# EAGLE schematic LCmeter0-LCD3310-8pinlcd-PIC-COMP (EAGLE 7.6.0)
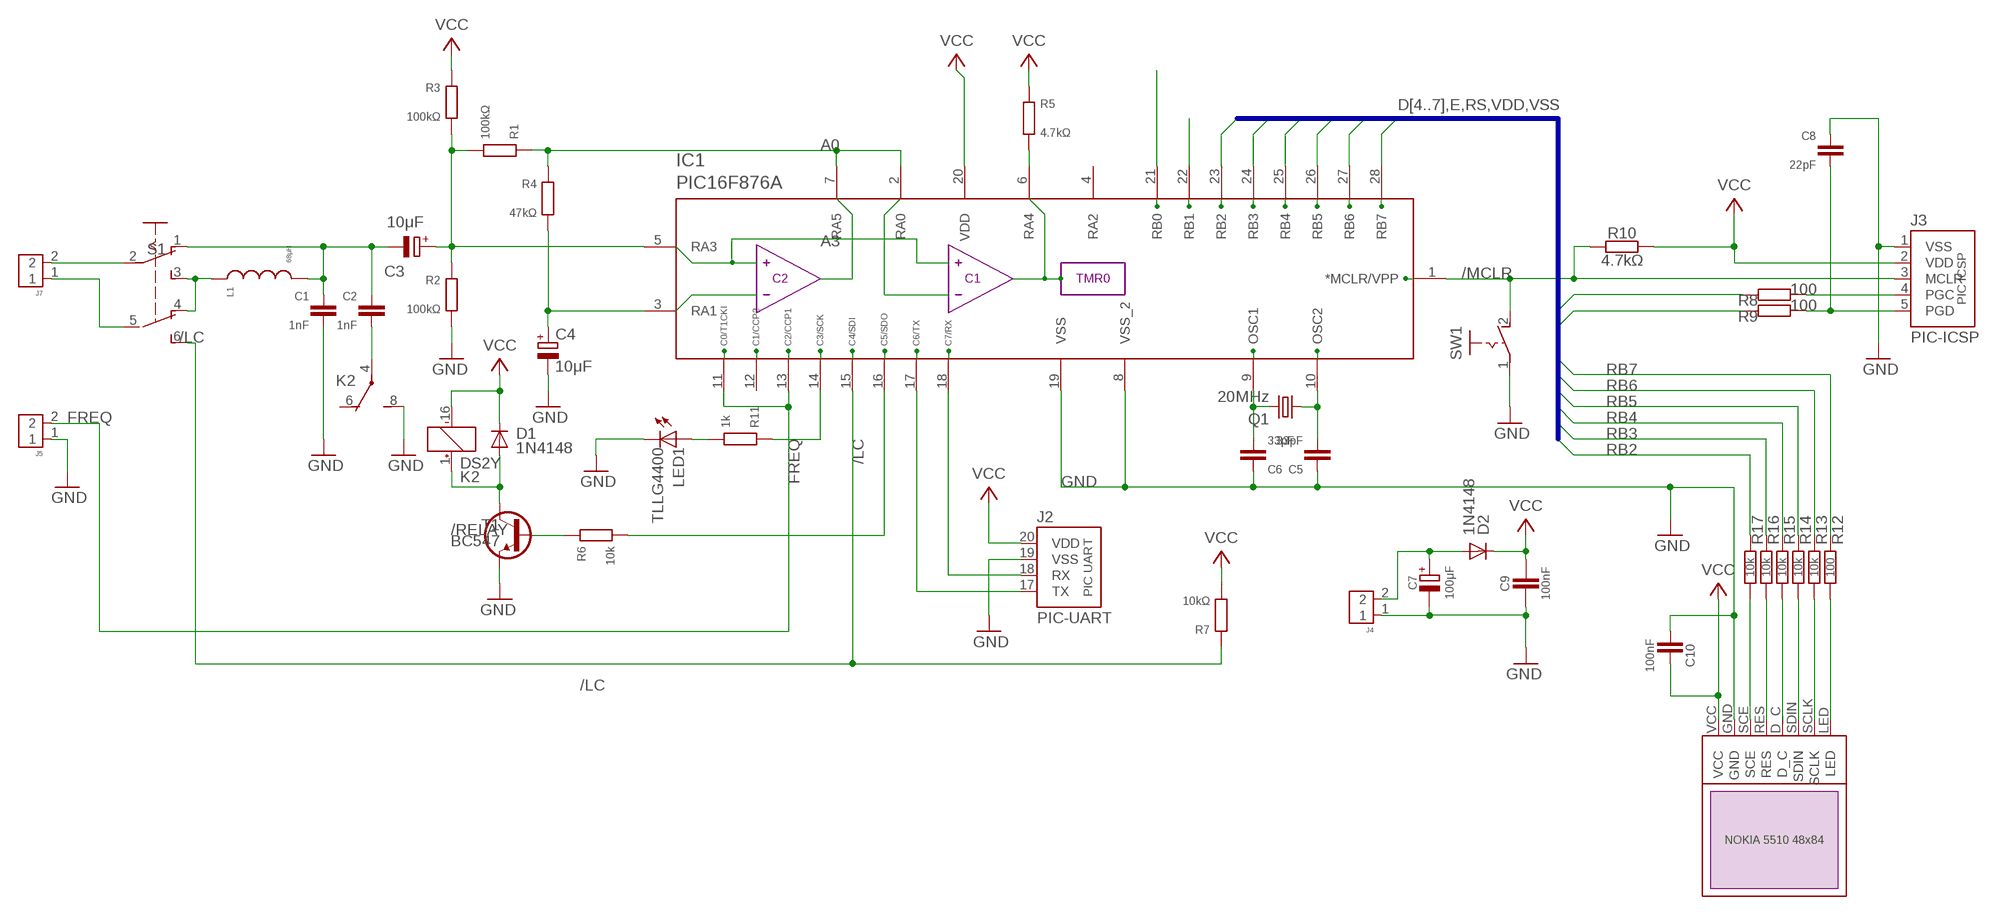
[diagram p0: schematic, sheet 1]

## Parts
C1  1nF  C025-025X060  [C050-025X060]
C2  1nF  C025-025X060  [C050-025X060]
C3  10μF  CPOLE2,5-4  [E2,5-4]
C4  10μF  CPOLE2,5-4  [E2,5-4]
C5  33pF  C025-020X036  [C025-020X036]
C6  33pF  C025-020X036  [C025-020X036]
C7  100μF  CPOLE5-5  [E5-5]
C8  22pF  C050-020X036  [C050-020X036]
C9  100nF  C-EU025-024X044  [C025-024X044]
C10  100nF  C025-015X024  [C025-015X024/V]
D1  1N4148  1N414834-7  [DO34-7]
D2  1N4148  1N414834-10V  [DO34-10V]
IC1  PIC16F876A  PIC16F876A-X/SP-COMPDIL28-3/V  [DIL28-3/V]
J2  PIC-UART  [PIC-UART]
J3  PIC-ICSP  PIC-ICSPICSP  [PIC-ICSP]
J4  J4  CONN-2P2P/H  [CONN-2P]
J5  CONN-2P2P/V  [CONN-2P-V]
J6  NOKIA-5510-48X84  [CONN-LCD5510]
J7  CONN-2P2P/V  [CONN-2P-V]
K2  DS2Y  DS2Y-S-DC5V  [DS2Y]
L1  68μH  L-09R  [L-8R]
LED1  TLLG4400  [LED3MM]
Q1  20MHz  CRYSTALHC49  [HC49]
R1  100kΩ  R0202/7  [0202/7]
R2  100kΩ  R0202/7  [0202/7]
R3  100kΩ  R0202/7  [0202/7]
R4  47kΩ  R0202/7  [0202/7]
R5  4.7kΩ  R0202/7  [0202/7]
R6  10k  R0202/7-V  [0202/7-V]
R7  10kΩ  R0202/10-V  [0202/10-V]
R8  100  R0202/7  [0202/7]
R9  100  R0202/2V  [0202/2V]
R10  4.7kΩ  R0202/7  [0202/7]
R11  1k  R0202/5-V  [0202/5-V]
R12  100  R0202/7  [0202/7]
R13  10k  R0202/7  [0202/7]
R14  10k  R0202/7  [0202/7]
R15  10k  R0202/7  [0202/7]
R16  10k  R0202/7  [0202/7]
R17  10k  R0202/7  [0202/7]
S1  SL-SW-2P-2T-H  [SLSW-2P2T-H]
SW1  PB-1P-1T  [PB-1P1T]
T1  BC547  BC547CBE-A  [TO92-CBE-A]

## Nets
/LC: IC1.15(RC4) R7.2 S1.6(S1)
/MCLR: IC1.1(*MCLR/VPP) J3.3(MCLR) R10.2 SW1.2(S)
/RELAY: D1.A K2.1(1:+) T1.C
A0: IC1.2(RA0) IC1.7(RA5) R1.2 R4.2
A1: C4.+ IC1.3(RA1) R4.1
A3: C3.+ IC1.5(RA3) R1.1 R2.2 R3.1
A4: IC1.6(RA4) R5.1
C2_CON: C2.2 K2.4(2:P)
FREQ: IC1.11(RC0) IC1.13(RC2) J5.2
GND: C1.2 C4.- C5.1 C6.1 C7.- C8.1 C9.2 C10.1 IC1.8(VSS_2) IC1.19(VSS) J2.19(VSS) J3.1(VSS) J4.1 J5.1 J6.GND K2.8(2:S) LED1.K(C) R2.1 SW1.1(P) T1.E
M+: J7.2 S1.2(P)
M-: J7.1 S1.5(P1)
N$1: LED1.A R11.1
N$2: C1.1 C2.1 C3.- L1.P$2 S1.1(O)
N$3: J6.LED R12.1
N$4: J6.D_C R15.1
N$5: IC1.14(RC3) R11.2
N$6: R6.2 T1.B
N$7: L1.P$1 S1.3(S) S1.4(O1)
N$8: IC1.16(RC5) R6.1
N$9: IC1.18(RC7) J2.18(RX)
N$10: IC1.17(RC6) J2.17(TX)
N$11: IC1.21(RB0)
N$12: C7.+ D2.A J4.2
N$13: J6.SDIN R14.1
N$14: J6.SCLK R13.1
N$15: J6.RES R16.1
N$16: J6.SCE R17.1
N$17: IC1.22(RB1)
OSC1: C6.2 IC1.9(OSC1) Q1.2
OSC2: C5.2 IC1.10(OSC2) Q1.1
PGC: J3.4(PGC) R8.1
PGD: C8.2 J3.5(PGD) R9.1
RB2: IC1.23(RB2) R17.2
RB3: IC1.24(RB3) R16.2
RB4: IC1.25(RB4) R15.2
RB5: IC1.26(RB5) R14.2
RB6: IC1.27(RB6) R8.2 R13.2
RB7: IC1.28(RB7) R9.2 R12.2
VCC: C9.1 C10.2 D1.C D2.C IC1.20(VDD) J2.20(VDD) J3.2(VDD) J6.VCC K2.16(1:-) R3.2 R5.2 R7.1 R10.1
Unconnected: IC1.4(RA2) IC1.12(RC1) K2.6(2:O) K2.9(3:S) K2.11(3:O) K2.13(3:P)

## Buses
D[4..7],E,RS,VDD,VSS

## Library data of the parts
C1 C2 C5 C6 C8 C10 = c:C: CAPACITOR, European symbol
C3 C4 C7 = c:CPOL: POLARIZED CAPACITOR, European symbol
C9 = rcl:C-EU: CAPACITOR, European symbol
D1 D2 = d:1N4148
IC1 = mcu:PIC16F876A-X/SP-COMP
J2 = pinconn:PIC-UART
J3 = pinconn:PIC-ICSP
J4 J5 J7 = pinconn:CONN-2P
J6 = lcd:NOKIA-5510-48X84
K2 = relay:DS2Y-S-DC*: MINIATURE RELAY NAiS Source: http://www.mew-europe.com/.. en_ds_61005_0023.pdf; MPN: DS2Y-S-DC5V; OC_FARNELL: unknown; OC_NEWARK: 13P3268
L1 = r:L
LED1 = led:TLLG4400: Low Current (2mA) LED 3 mm Tinted Diffused Package color GREEN Source: Data sheet <http://www.farnell.com/datasheets/391098.pdf>; MF: VISHAY SEMICONDUCTOR; OC_FARNELL: 1612435
Q1 = q:CRYSTAL
R1-R17 = r:R: RESISTOR, European symbol
S1 = sw:SL-SW-2P-2T
SW1 = sw:PB-1P-1T
T1 = t:BC547

## Net classes
0 default: width 0.61 mm